# Altium schematic sheet USB.SchDoc
size A4; Engineer: Naif aljohani; DocumentNumber: 4; Revision: v1.0; SheetNumber: 4; SheetTotal: 8; SPICEModelCacheVKQZRFRK: <root> / <DocumentId>VKQZRFRK</DocumentId> / <CacheFrame Number="0"> / <Model Name="1n4148" Kind="MDL"> / <Text>.model 1N4148  D(Is=0.1p Rs=16 CJO=2p Tt=12n Bv=100 Ibv=0.1p)</Text> / </Model> / </CacheFrame> / </root>
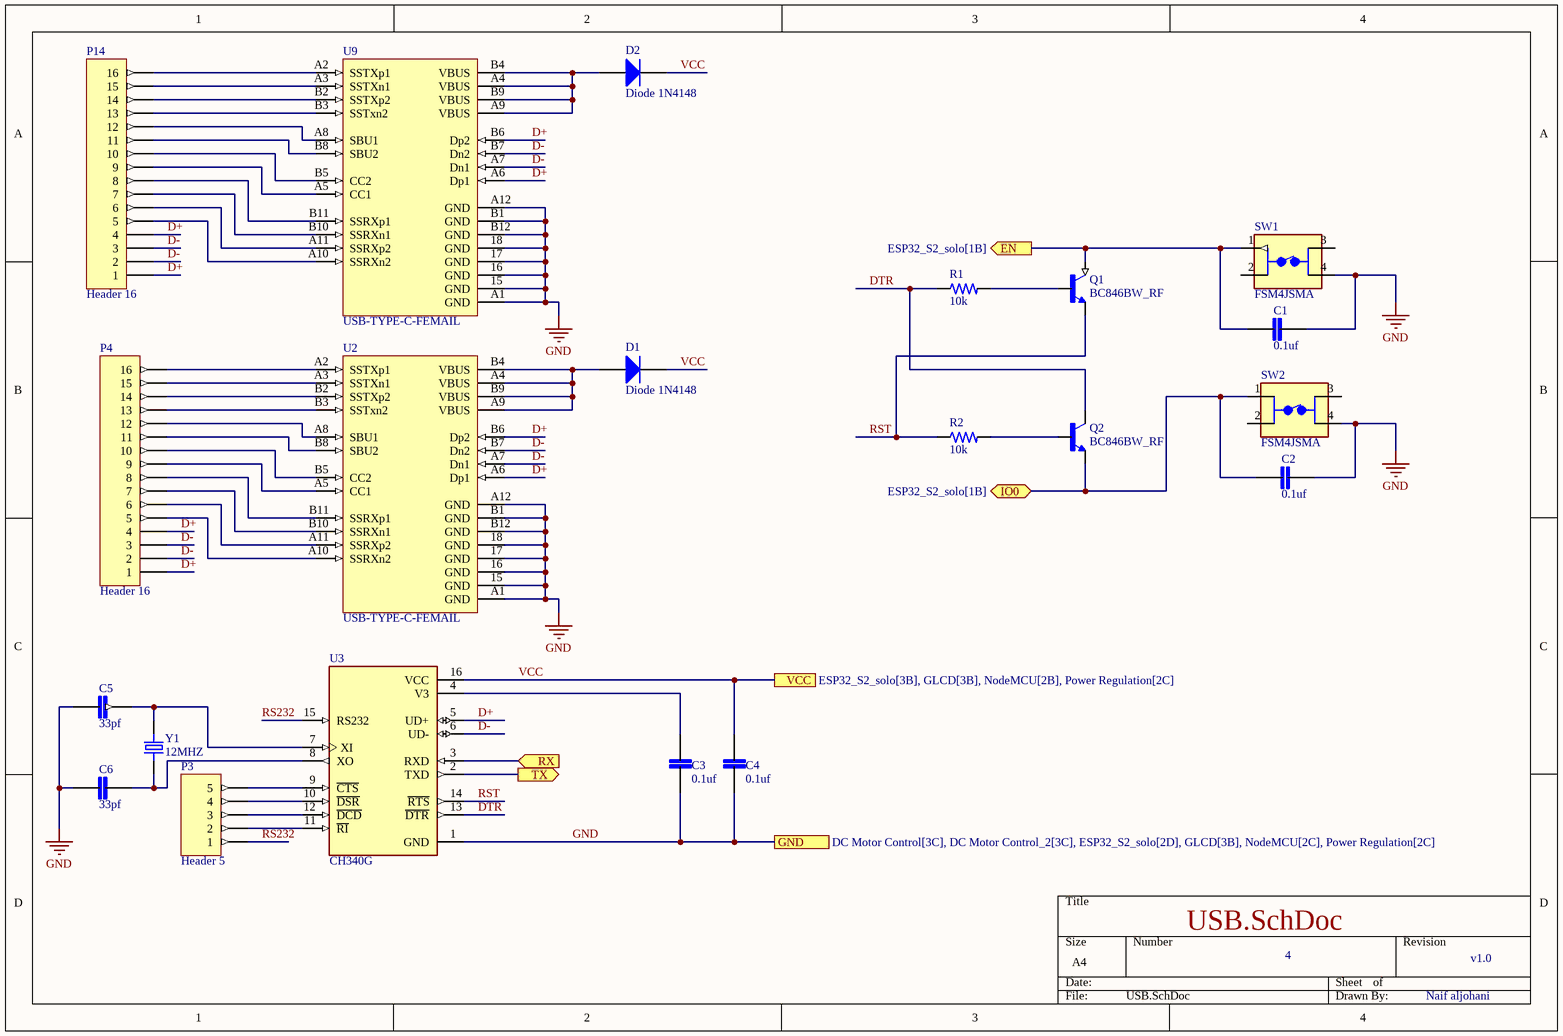
[diagram p0: USB.SchDoc]

## Parts
C1  0.1uf  [CAPC2012X140N]
C2  0.1uf  [CAPC2012X140N]
C3  0.1uf  [CAPC2012X140N]
C4  0.1uf  [CAPC2012X140N]
C5  33pf  [CAPC2012X140N]
C6  33pf  [CAPC2012X140N]
D1  Diode 1N4148  [DO-35]
D2  Diode 1N4148  [DO-35]
P3  Header 5  [HDR1X5]
P4  Header 16  [HDR1X16]
P14  Header 16  [HDR1X16]
Q1  BC846BW_RF  [TRANS_BC846BW_RF]
Q2  BC846BW_RF  [TRANS_BC846BW_RF]
R1  10k  [RESC3115X65N]
R2  10k  [RESC3115X65N]
SW1  FSM4JSMA  [TE_FSM4JSMA]
SW2  FSM4JSMA  [TE_FSM4JSMA]
U2  USB-TYPE-C-FEMAIL  [C5156605]
U3  CH340G  [SOIC127P600X180-16N]
U9  USB-TYPE-C-FEMAIL  [C5156605]
Y1  12MHZ  [XTAL_ECS-51-S-1]

## Ports
EN (out, see ESP32_S2_solo[1B]), GND (see DC Motor Control[3C], DC Motor Control_2[3C], ESP32_S2_solo[2D], GLCD[3B], NodeMCU[2C], Power Regulation[2C]), IO0 (bidir, see ESP32_S2_solo[1B]), RX (in), TX (out), VCC (see ESP32_S2_solo[3B], GLCD[3B], NodeMCU[2B], Power Regulation[2C])

## Nets
GND: C1.2 C2.2 C3.1 C4.1 C5.2 C6.2 SW1.4 SW2.4 U2.15(GND) U2.16(GND) U2.17(GND) U2.18(GND) U2.A1(GND) U2.A12(GND) U2.B1(GND) U2.B12(GND) U3.1(GND) U9.15(GND) U9.16(GND) U9.17(GND) U9.18(GND) U9.A1(GND) U9.A12(GND) U9.B1(GND) U9.B12(GND) ; port GND
D+: P4.1 P4.4 P14.1 P14.4 U2.A6(Dp1) U2.B6(Dp2) U3.5(UD+) U9.A6(Dp1) U9.B6(Dp2)
D-: P4.2 P4.3 P14.2 P14.3 U2.A7(Dn1) U2.B7(Dn2) U3.6(UD-) U9.A7(Dn1) U9.B7(Dn2)
DTR: Q2.3(C) R1.1 U3.13(~{DTR})
EN: C1.1 Q1.3(C) SW1.1 ; port EN
IO0: C2.1 Q2.2(E) SW2.1 ; port IO0
RS232: P3.1 U3.15(RS232)
RST: Q1.2(E) R2.1 U3.14(~{RTS})
RX: U3.3(RXD) ; port RX
TX: U3.2(TXD) ; port TX
VCC: C4.2 D1.2(K) D2.2(K) U3.16(VCC) ; port VCC
NetC3_2: C3.2 U3.4(V3)
NetC5_1: C5.1 U3.7(XI) Y1.2
NetC6_1: C6.1 U3.8(XO) Y1.1
NetD1_1: D1.1(A) U2.A4(VBUS) U2.A9(VBUS) U2.B4(VBUS) U2.B9(VBUS)
NetD2_1: D2.1(A) U9.A4(VBUS) U9.A9(VBUS) U9.B4(VBUS) U9.B9(VBUS)
NetP3_2: P3.2 U3.11(~{RI})
NetP3_3: P3.3 U3.12(~{DCD})
NetP3_4: P3.4 U3.10(~{DSR})
NetP3_5: P3.5 U3.9(~{CTS})
NetP4_5: P4.5 U2.A10(SSRXn2)
NetP4_6: P4.6 U2.A11(SSRXp2)
NetP4_7: P4.7 U2.B10(SSRXn1)
NetP4_8: P4.8 U2.B11(SSRXp1)
NetP4_9: P4.9 U2.A5(CC1)
NetP4_10: P4.10 U2.B5(CC2)
NetP4_11: P4.11 U2.B8(SBU2)
NetP4_12: P4.12 U2.A8(SBU1)
NetP4_13: P4.13 U2.B3(SSTxn2)
NetP4_14: P4.14 U2.B2(SSTXp2)
NetP4_15: P4.15 U2.A3(SSTXn1)
NetP4_16: P4.16 U2.A2(SSTXp1)
NetP14_5: P14.5 U9.A10(SSRXn2)
NetP14_6: P14.6 U9.A11(SSRXp2)
NetP14_7: P14.7 U9.B10(SSRXn1)
NetP14_8: P14.8 U9.B11(SSRXp1)
NetP14_9: P14.9 U9.A5(CC1)
NetP14_10: P14.10 U9.B5(CC2)
NetP14_11: P14.11 U9.B8(SBU2)
NetP14_12: P14.12 U9.A8(SBU1)
NetP14_13: P14.13 U9.B3(SSTxn2)
NetP14_14: P14.14 U9.B2(SSTXp2)
NetP14_15: P14.15 U9.A3(SSTXn1)
NetP14_16: P14.16 U9.A2(SSTXp1)
NetQ1_1: Q1.1(B) R1.2
NetQ2_1: Q2.1(B) R2.2

Not connected (* = marked no-connect by the designer): SW1 2 3; SW2 2 3

## Library data of the parts
C1-C6 = LD051A121KAB2A: 120PF 100V 10% 0805; MF: {'manufacturer': u'AVX'}; Package: None; Price: None; Value: *; MP: LD051A121KAB2A; Availability: Unavailable
D1 D2 = Diode 1N4148: High Conductance Fast Diode; Published: 8-Jun-2000; LatestRevisionDate: 17-Jul-2002; LatestRevisionNote: Re-released for DXP Platform.; DatasheetVersion: 1997; PackageReference: DO-35; Publisher: Altium Limited; PackageDescription: Diode, Axial; Body 3.8 x 1.9 mm (LxDia. max), Lead Dia. 0.53 mm (max); Code_JEDEC: DO-204-AH; ComponentLink1Description: Manufacturer Link; ComponentLink1URL: http://www.fairchildsemi.com/; ComponentLink2Description: Datasheet; ComponentLink2URL: http://www.fairchildsemi.com/ds/1N%2F1N4148.pdf
P3 = Header 5: Header, 5-Pin; LatestRevisionDate: 17-Jul-2002; LatestRevisionNote: Re-released for DXP Platform.; Publisher: Altium Limited
P4 P14 = Header 16: Header, 16-Pin; LatestRevisionDate: 17-Jul-2002; LatestRevisionNote: Re-released for DXP Platform.; Publisher: Altium Limited
Q1 Q2 = BC846BW_RF: MF: {'manufacturer': u'Taiwan Semiconductor'}; Package: None; Price: None; Value: *; MP: BC846BW_RF; Availability: Unavailable
R1 R2 = 1-1879462-4: RL73H 2B R43 1% 10 RL; MF: {'manufacturer': u'TE Connectivity'}; Package: None; Price: None; Value: *; MP: 1-1879462-4; Availability: Unavailable
SW1 SW2 = FSM4JSMA: Switch Tactile OFF (ON) SPST Round Button Gull Wing 0.05A 24VDC 2.6N SMD T/R; MF: {'manufacturer': u'TE Connectivity'}; Value: *; Price: None; Availability: Unavailable; Package: None; MP: FSM4JSMA
U3 = CH340G: MF: {'manufacturer': u'WCH'}; MP: CH340G; Package: None; Price: None; Value: *; Availability: Unavailable
Y1 = ECS-51-S-1: MF: {'manufacturer': u'ECS'}; Package: None; Price: None; Value: *; MP: ECS-51-S-1; Availability: Unavailable